# EAGLE design robotarm (EAGLE 9.3.0)
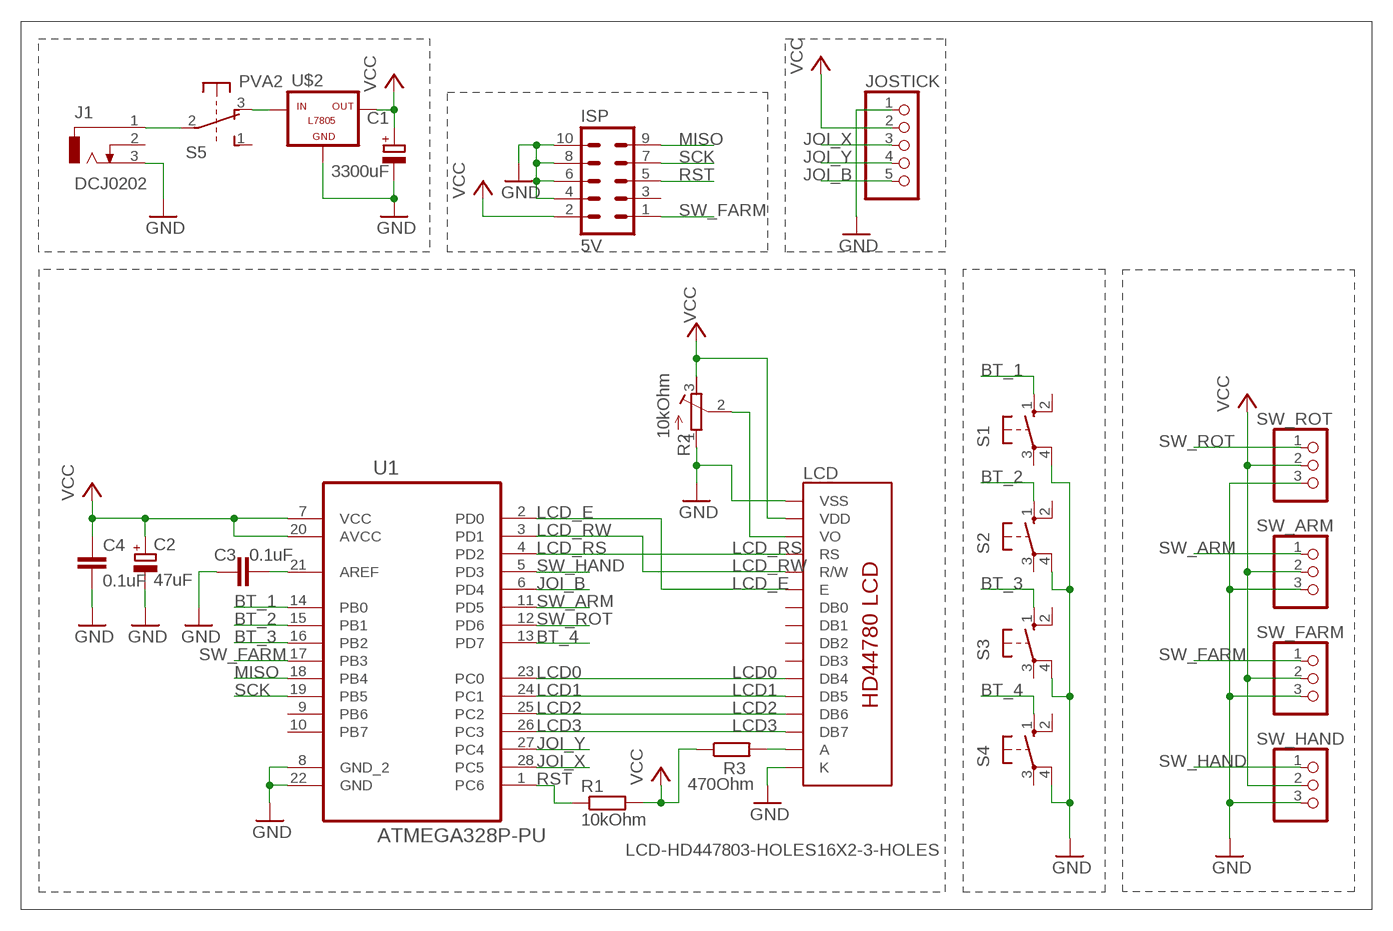
[diagram p0: schematic, sheet 1]

## Parts
C1  3300uF  CPOL-EUE3.5-10  [E3,5-10]
C2  47uF  CPOL-EUE2.5-6  [E2,5-6]
C3  0.1uF  C-EU025-024X044  [C025-024X044]
C4  0.1uF  C-EU025-024X044  [C025-024X044]
ISP  5V  ML10  [ML10]
J1  DCJ0202  [DCJ0202]
JOSTICK  PINHD-1X5  [1X05]
LCD  LCD-HD447803-HOLES16X2-3-HOLES  [LCD-16X2-3HOLES]
R1  10kOhm  R-EU_0204/7  [0204/7]
R2  10kOhm  R-TRIMM3339P  [RTRIM3339P]
R3  470Ohm  R-EU_0204/7  [0204/7]
S1  10-XX  [B3F-10XX]
S2  10-XX  [B3F-10XX]
S3  10-XX  [B3F-10XX]
S4  10-XX  [B3F-10XX]
S5  PVA2  [PVA2F]
SW_ARM  PINHD-1X3  [1X03]
SW_FARM  PINHD-1X3  [1X03]
SW_HAND  PINHD-1X3  [1X03]
SW_ROT  PINHD-1X3  [1X03]
U1  ATMEGA328P-PU  [DIP254P762X457-28]
U$2  -L7805  [L7805]

## Nets
BT_1: S1.1(S) U1.14(PB0)
BT_2: S2.1(S) U1.15(PB1)
BT_3: S3.1(S) U1.16(PB2)
BT_4: S4.1(S) U1.13(PD7)
GND: C1.- C2.- C3.1 C4.2 ISP.4 ISP.6 ISP.8 ISP.10 J1.3 JOSTICK.1 LCD.1(VSS) LCD.16(K) R2.1(A) S1.4(P1) S2.4(P1) S3.4(P1) S4.4(P1) SW_ARM.3 SW_FARM.3 SW_HAND.3 SW_ROT.3 U1.8(GND_2) U1.22(GND) U$2.GND
JOI_B: JOSTICK.5 U1.6(PD4)
JOI_X: JOSTICK.3 U1.28(PC5)
JOI_Y: JOSTICK.4 U1.27(PC4)
LCD0: LCD.11(DB4) U1.23(PC0)
LCD1: LCD.12(DB5) U1.24(PC1)
LCD2: LCD.13(DB6) U1.25(PC2)
LCD3: LCD.14(DB7) U1.26(PC3)
LCD_E: LCD.6(E) U1.2(PD0)
LCD_RS: LCD.4(RS) U1.4(PD2)
LCD_RW: LCD.5(R/W) U1.3(PD1)
MISO: ISP.9 U1.18(PB4)
N$1: J1.1 S5.2(1:P)
N$2: S5.3(1:O) U$2.IN
N$3: LCD.3(VO) R2.2(S)
N$4: LCD.15(A) R3.2
N$5: C3.2 U1.21(AREF)
RST: ISP.5 R1.1 U1.1(PC6)
SCK: ISP.7 U1.19(PB5)
SW_ARM: SW_ARM.1 U1.11(PD5)
SW_FARM: ISP.1 SW_FARM.1 U1.17(PB3)
SW_HAND: SW_HAND.1 U1.5(PD3)
SW_ROT: SW_ROT.1 U1.12(PD6)
VCC: C1.+ C2.+ C4.1 ISP.2 JOSTICK.2 LCD.2(VDD) R1.2 R2.3(E) R3.1 SW_ARM.2 SW_FARM.2 SW_HAND.2 SW_ROT.2 U1.7(VCC) U1.20(AVCC) U$2.OUT
Unconnected: ISP.3 J1.2 LCD.7(DB0) LCD.8(DB1) LCD.9(DB2) LCD.10(DB3) S1.2(S1) S1.3(P) S2.2(S1) S2.3(P) S3.2(S1) S3.3(P) S4.2(S1) S4.3(P) S5.1(1:S) S5.4(2:S) S5.5(2:P) S5.6(2:O) U1.9(PB6) U1.10(PB7)

## Library data of the parts
C1 C2 = rcl:CPOL-EU: POLARIZED CAPACITOR, European symbol; SPICEPREFIX: C
C3 C4 = rcl:C-EU: CAPACITOR, European symbol; SPICEPREFIX: C
ISP = con-harting-ml:ML10: HARTING; OC_FARNELL: unknown; OC_NEWARK: unknown
J1 = con-jack:DCJ0202: DC POWER JACK Source: DCJ0202.pdf; OC_FARNELL: unknown; OC_NEWARK: unknown
JOSTICK = pinhead:PINHD-1X5: PIN HEADER
LCD = HD44780LCD:LCD-HD44780
R1 R3 = rcl:R-EU_: RESISTOR, European symbol; SPICEPREFIX: R
R2 = rcl:R-TRIMM: Trimm resistor; SPICEMODEL: X; SPICEPREFIXL: POT
S1-S4 = switch-omron:10-XX: OMRON SWITCH; MPN: B3F-1000; OC_FARNELL: 176432; OC_NEWARK: 36M3542
S5 = switch-misc:PVA2: ITT SWITCH
SW_ARM SW_FARM SW_HAND SW_ROT = pinhead:PINHD-1X3: PIN HEADER
U1 = Atmel_By_element14_Batch_1-00:ATMEGA328P-PU: 8-bit Microcontroller with In-System Programmable Flash; MPN: ATMEGA328P-PU; OC_FARNELL: 1715487; OC_NEWARK: 15R0268; PACKAGE: PDIP-28; SUPPLIER: Atmel
U$2 = tango:-L7805

## Board
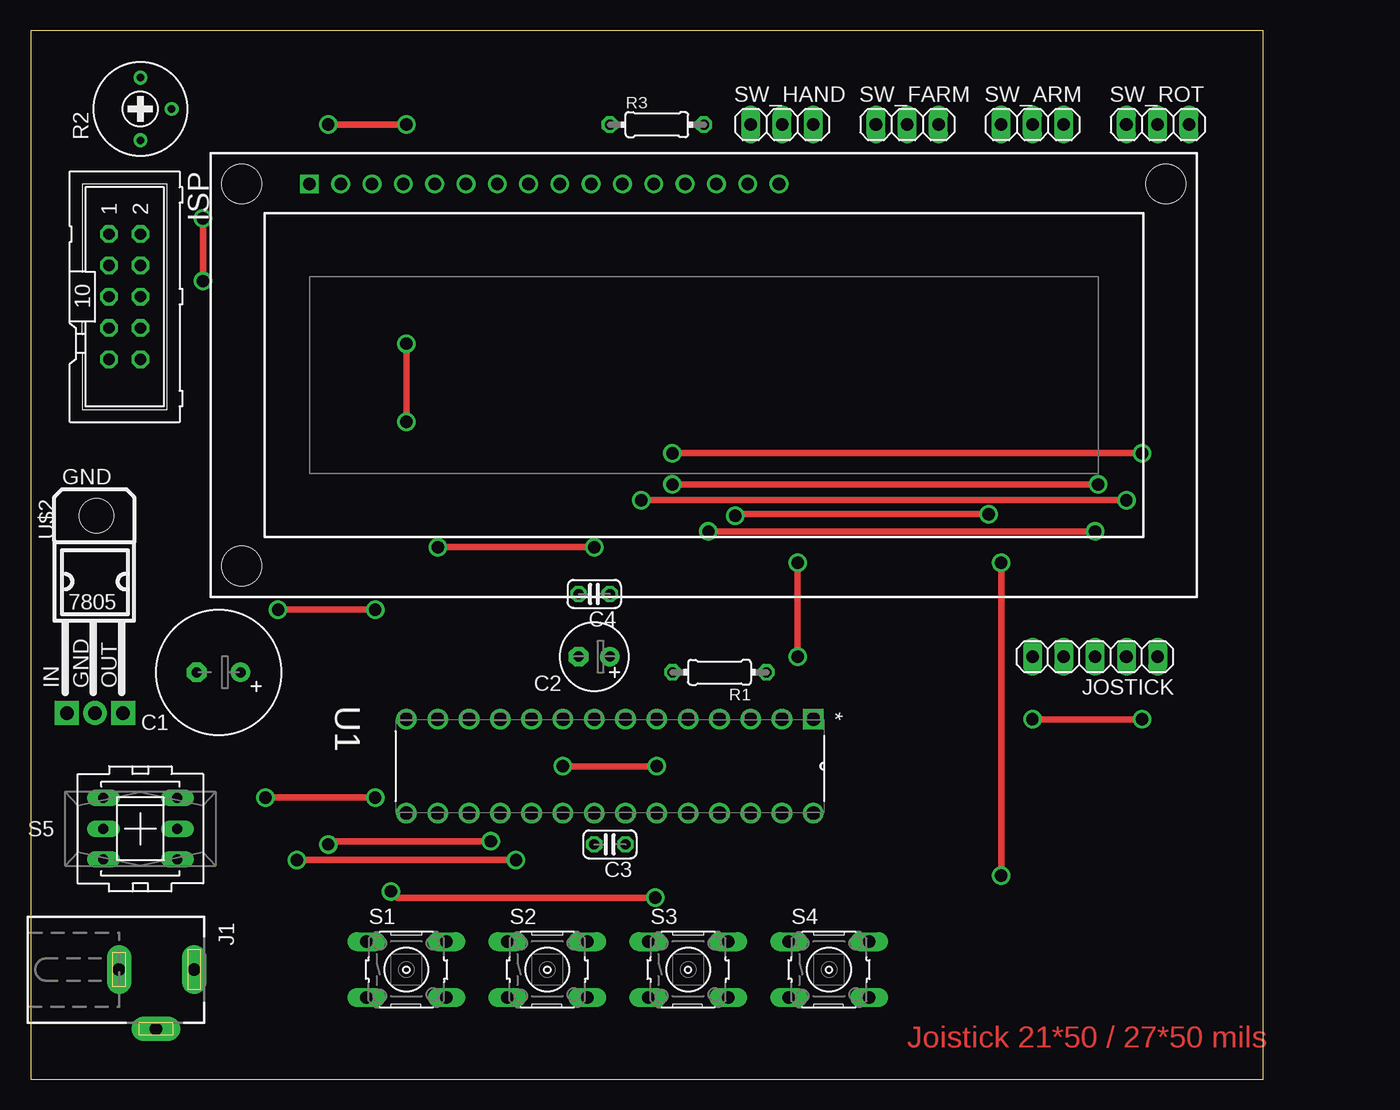
[diagram p1: board, top side]
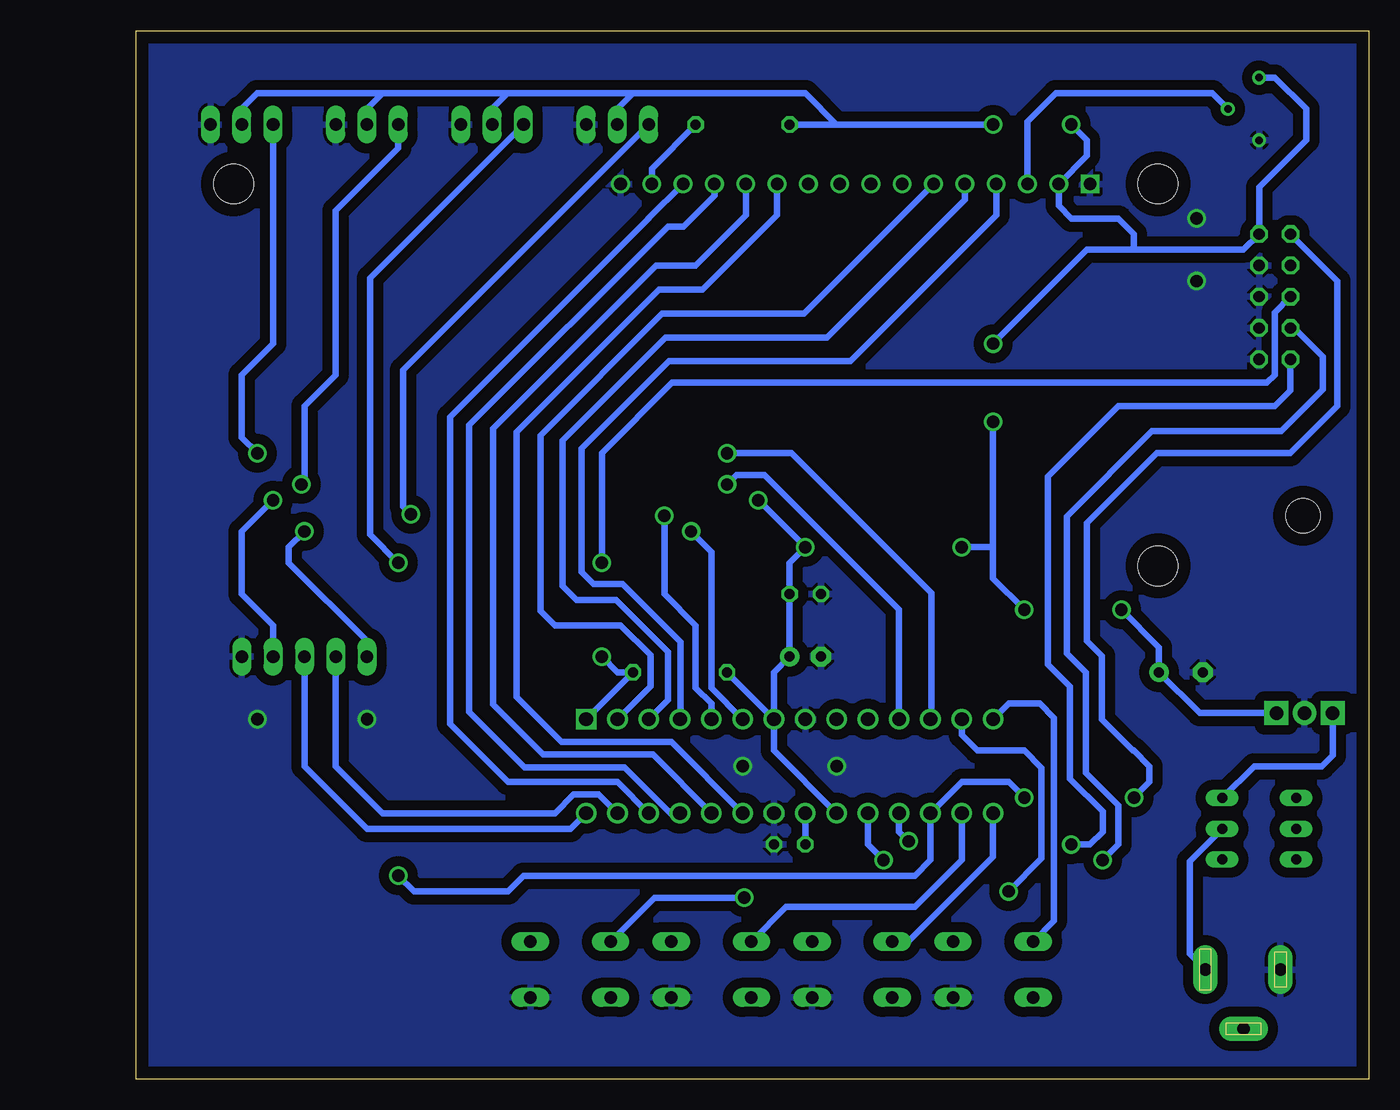
[diagram p2: board, bottom side, seen from below]

Size 100 x 85.08 mm. Coordinates in mm from the lower left corner, seen from the top.
Outline: 0,0 100,0 100,85.08 0,85.08 0,0
Copper layers (1*16): Top 0.035mm / dielectric 1.5mm / Bottom 0.035mm
Design rules "default": minimum track width 6mil, minimum drill 0.35mm, track to track 6mil, track to pad 6mil, pad to pad 6mil, via to via 6mil, smd to smd 6mil, copper to edge 40mil, drill to drill 6mil, minimum pad ring 10mil, minimum via ring 8mil, stop-mask expansion 4mil, vias tented up to drill 0mil, thermal gap 10mil

### Footprints (pad centres in the part's own frame; a part is rotated, then mirrored left to right if it is on the bottom)
E3,5-10 = drill 0.813 pad 1.6: + -1.778,0 | drill 0.813 pad 1.6 octagon: - 1.778,0
E2,5-6 = drill 0.813 pad 1.6: + -1.27,0 | drill 0.813 pad 1.6 octagon: - 1.27,0
C025-024X044 = drill 0.813 octagon: 1 -1.27,0; 2 1.27,0
ML10 = drill 0.914 octagon: 1 -5.08,-1.27; 2 -5.08,1.27; 3 -2.54,-1.27; 4 -2.54,1.27; 5 0,-1.27; 6 0,1.27; 7 2.54,-1.27; 8 2.54,1.27; 9 5.08,-1.27; 10 5.08,1.27
DCJ0202 = drill 1 pad 2 long: 1 0,3.1; 2 4.8,0; 3 0,-3
1X05 = drill 1.016 long: 1 -5.08,0; 2 -2.54,0; 3 0,0; 4 2.54,0; 5 5.08,0
LCD-16X2-3HOLES = drill 1.016 square: 1 -32,15.5 | drill 1.016: 2 -29.46,15.5; 3 -26.92,15.5; 4 -24.38,15.5; 5 -21.84,15.5; 6 -19.3,15.5; 7 -16.76,15.5; 8 -14.22,15.5; 9 -11.68,15.5; 10 -9.14,15.5; 11 -6.6,15.5; 12 -4.06,15.5; 13 -1.52,15.5; 14 1.02,15.5; 15 3.56,15.5; 16 6.1,15.5 | hole 3.2: -37.5,15.5; -37.5,-15.5; 37.5,15.5
0204/7 = drill 0.813 octagon: 1 -3.81,0; 2 3.81,0
RTRIM3339P = drill 0.61: 1 -2.54,0; 2 0,-2.54; 3 2.54,0
B3F-10XX = drill 1.016 long: 1 -3.251,2.261; 2 3.251,2.261; 3 -3.251,-2.261; 4 3.251,-2.261
PVA2F = drill 0.813 long: 1 -2.997,2.489; 2 -2.997,0; 3 -2.997,-2.489; 4 2.997,2.489; 5 2.997,0; 6 2.997,-2.489
1X03 = drill 1.016 long: 1 -2.54,0; 2 0,0; 3 2.54,0
DIP254P762X457-28 = drill 1.118 square: 1 -7.62,33.02 | drill 1.118: 2 -7.62,30.48; 3 -7.62,27.94; 4 -7.62,25.4; 5 -7.62,22.86; 6 -7.62,20.32; 7 -7.62,17.78; 8 -7.62,15.24; 9 -7.62,12.7; 10 -7.62,10.16; 11 -7.62,7.62; 12 -7.62,5.08; 13 -7.62,2.54; 14 -7.62,0; 15 0,0; 16 0,2.54; 17 0,5.08; 18 0,7.62; 19 0,10.16; 20 0,12.7; 21 0,15.24; 22 0,17.78; 23 0,20.32; 24 0,22.86; 25 0,25.4; 26 0,27.94; 27 0,30.48; 28 0,33.02
L7805 = drill 1.1 pad 1.93: GND 0.127,-9.652 | drill 1.1 pad 1.93 square: IN -2.159,-9.652; OUT 2.413,-9.652 | hole 2.8: 0.254,6.35

### Placement (x,y rotation side)
C1  15.24,33.02 180 top
C2  45.72,34.29 180 top
C3  46.99,19.05 180 top
C4  45.72,39.37 180 top
ISP  7.62,63.5 270 top
J1  10.16,8.89 270 top
JOSTICK  86.36,34.29 180 top
LCD  54.61,57.15 0 top
R1  55.88,33.02 180 top
R2  8.89,78.74 90 top
R3  50.8,77.47 0 top
S1  30.48,8.89 0 top
S2  41.91,8.89 0 top
S3  53.34,8.89 0 top
S4  64.77,8.89 0 top
S5  8.89,20.32 180 top
SW_ARM  81.28,77.47 0 top
SW_FARM  71.12,77.47 0 top
SW_HAND  60.96,77.47 0 top
SW_ROT  91.44,77.47 0 top
U1  30.48,21.59 270 top
U$2  5.08,39.37 0 top

### Tracks (layer width: path | path; a pad name or v marks a point on that pad's centre or on a via)
BT_1
  Bottom 0.508: U1.14 29.21,30.48 26.67,30.48 25.53,29.34 25.53,12.85 S1.1
BT_2
  Bottom 0.508: S2.1 37.39,11.15 30.48,18.06 U1.15
BT_3
  Bottom 0.508: S3.1 47.27,13.97 36.83,13.97 33.02,17.78 U1.16
BT_4  (via drill 1)
  Top 0.508: v50.67,14.73 29.72,14.73 v29.21,15.24
  Bottom 0.508: S4.1 57.94,14.73 v50.67,14.73 | v29.21,15.24 26.54,17.91 26.54,25.27 27.94,26.67 31.75,26.67 33.02,27.94 U1.13
GND  (via drill 1)
  Top 0.508: v81.28,29.21 v90.17,29.21 | v50.8,25.4 v43.18,25.4 | v13.97,69.85 v13.97,64.77
  Bottom 0.508: 8.97,76.12 R2.1
  pour Bottom (isolate 0.813): -33.02,87.63 101.6,87.63 101.6,-2.54 -33.02,-2.54
JOI_B  (via drill 1)
  Top 0.508: v86.36,44.45 v54.99,44.45
  Bottom 0.508: JOSTICK.5 81.28,35.56 87.63,41.91 87.63,43.18 v86.36,44.45 | U1.6 53.34,31.75 53.34,42.8 v54.99,44.45
JOI_X
  Bottom 0.508: U1.28 64.77,20.32 81.28,20.32 86.36,25.4 JOSTICK.3
JOI_Y
  Bottom 0.508: U1.27 62.48,23.11 64.52,23.11 66.04,21.59 80.01,21.59 83.82,25.4 JOSTICK.4
LCD0
  Bottom 0.508: U1.23 56.59,27.38 65.48,27.38 69.14,31.04 69.14,52.52 57.6,64.06 54.05,64.06 48.01,70.1 LCD.11
LCD1
  Bottom 0.508: U1.24 58.09,26.34 66.98,26.34 71.07,30.43 71.07,52.79 57.82,66.04 54.61,66.04 50.55,70.1 LCD.12
LCD2
  Bottom 0.508: U1.25 56.66,21.59 60.37,25.3 68.48,25.3 73,29.82 73,53.07 56.88,69.19 55.61,69.19 53.09,71.71 LCD.13
LCD3
  Bottom 0.508: U1.26 60.96,24.13 69.85,24.13 74.55,28.83 74.55,53.72 58.42,69.85 58.42,69.86 LCD.14
LCD_E
  Bottom 0.508: U1.2 58.29,31.88 58.29,34.42 60.71,36.83 66.04,36.83 67.21,38 67.21,52.25 57.33,62.13 45.82,62.13 LCD.6
LCD_RS
  Bottom 0.508: U1.4 55.83,29.26 55.83,35.47 60.54,40.18 62.92,40.18 63.88,41.15 63.88,51.16 56.78,58.27 42.06,58.27 30.23,70.1 LCD.4
LCD_RW
  Bottom 0.508: U1.3 56.87,30.76 56.87,34.69 61.07,38.89 64.29,38.89 65.41,40.01 65.41,51.84 57.05,60.2 43.95,60.2 32.77,71.38 LCD.5
MISO  (via drill 1)
  Top 0.508: v37.34,19.3 24.38,19.3 v24.13,19.05
  Bottom 0.508: ISP.9 6.35,55.88 7.62,54.61 20.32,54.61 26.04,48.9 26.04,33.66 24.26,31.88 24.26,24.38 21.59,21.72 21.59,20.07 22.61,19.05 v24.13,19.05 | U1.18 38.1,20.07 v37.34,19.3
N$1
  Bottom 0.508: J1.1 14.53,10.16 14.53,17.68 S5.2
N$2
  Bottom 0.508: S5.3 9.3,25.4 3.81,25.4 2.92,26.29 U$2.IN
N$3
  Bottom 0.508: R2.2 12.7,80.01 25.4,80.01 27.69,77.72 LCD.3
N$4
  Bottom 0.508: R3.2 58.17,73.91 LCD.15
N$5
  Bottom 0.508: U1.21 C3.2
RST  (via drill 1)
  Top 0.508: v62.23,41.91 v62.23,34.29
  Bottom 0.508: U1.1 R1.1 60.96,33.02 v62.23,34.29 | ISP.5 7.62,62.23 7.62,57.15 8.26,56.52 56.52,56.52 62.23,50.8 v62.23,41.91
SCK  (via drill 1)
  Top 0.508: v39.37,17.78 v21.59,17.78
  Bottom 0.508: U1.19 40.64,19.05 v39.37,17.78 | v21.59,17.78 20.32,19.05 20.32,22.23 22.96,24.87 22.96,32.99 24.51,34.54 24.51,45.67 17.61,52.58 7.11,52.58 3.71,55.98 3.71,58.63 6.04,60.96 ISP.7
SW_ARM  (via drill 1)
  Top 0.508: v52.07,48.26 v86.61,48.26
  Bottom 0.508: U1.11 38.1,38.1 49.02,49.02 51.31,49.02 v52.07,48.26 | v86.61,48.26 86.36,48.51 86.36,54.61 83.82,57.15 83.82,70.48 78.74,75.56 SW_ARM.1
SW_FARM  (via drill 1)
  Top 0.508: v27.94,22.86 v19.05,22.86 | v78.74,16.51 v78.74,41.91
  Bottom 0.508: v78.74,16.51 77.47,15.24 69.85,15.24 68.58,16.51 36.83,16.51 35.56,17.78 U1.17 33.02,24.13 29.21,24.13 v27.94,22.86 | v78.74,41.91 81.03,44.2 81.03,65.02 SW_FARM.1 | v19.05,22.86 17.78,24.13 17.78,25.4 19.05,26.67 19.13,26.67 21.67,29.21 21.67,34.37 22.86,35.56 22.86,45.12 17.18,50.8 6.35,50.8 2.54,54.61 2.54,64.77 ISP.1
SW_HAND  (via drill 1)
  Top 0.508: v77.72,45.85 57.28,45.85 v57.15,45.72
  Bottom 0.508: SW_HAND.1 78.36,57.53 78.36,46.48 v77.72,45.85 | U1.5 53.34,30.48 54.61,31.75 54.61,36.83 57.15,39.37 v57.15,45.72
SW_ROT  (via drill 1)
  Top 0.508: v52.07,50.8 v90.17,50.8
  Bottom 0.508: U1.12 35.48,29.29 35.48,39.45 46.84,50.8 v52.07,50.8 | SW_ROT.1 88.9,59.69 91.44,57.15 91.44,52.07 v90.17,50.8
VCC  (via drill 1)
  Top 0.508: v20.07,38.1 v27.94,38.1 | v33.02,43.18 v45.72,43.18 | v49.53,46.99 v88.9,46.99 | v30.48,59.69 v30.48,53.34 | v30.48,77.47 v24.13,77.47
  Bottom 0.508: R1.2 U1.7 | U1.20 48.26,26.67 U1.7 | U1.7 48.26,33.02 C2.+ C4.1 46.99,41.91 v45.72,43.18 v49.53,46.99 | U$2.OUT 13.72,29.72 C1.+ 17.02,35.05 v20.07,38.1 | 30.48,43.18 v33.02,43.18 | JOSTICK.2 88.9,36.83 91.44,39.37 91.44,44.45 v88.9,46.99 | v30.48,53.34 30.48,43.18 | v30.48,59.69 22.86,67.31 19.05,67.31 | 19.05,67.31 19.05,68.58 20.32,69.85 24.13,69.85 25.15,70.87 LCD.2 22.86,74.93 22.86,76.2 v24.13,77.47 | 43.18,77.47 R3.1 | 43.18,77.47 45.71,80 59.7,80 | SW_ARM.2 81.28,78.74 80.02,80 | 59.7,80 69.86,80 | 69.86,80 80.02,80 | SW_FARM.2 71.12,78.74 69.86,80 | SW_HAND.2 60.96,78.74 59.7,80 | 80.02,80 90.18,80 91.44,78.74 SW_ROT.2 | 19.05,67.31 10.16,67.31 ISP.2 8.89,72.39 5.08,76.2 5.08,78.74 7.62,81.28 R2.3 | 43.18,77.47 v30.48,77.47 | v27.94,38.1 30.48,40.64 30.48,43.18

### Text on the board
Top: Joistick 21*50 / 27*50 mils